# Altium schematic sheet clock-3key.SchDoc
size A3; SPICEModelCacheRLVYLVLF: <root> / <DocumentId>RLVYLVLF</DocumentId> / <CacheFrame Number="0"> / <Model Name="qnpn" Kind="MDL"> / <Text>*QNPN / *NPN Trans Pinout: C,B,E / .MODEL QNPN NPN(IS=3.2E-16 BF=141 VAF=35 ISE=2.6 NE=1.46 CJE=1E-13 / + MJE=0.333 TF=6E-11 CJC=1E-13 CJS=2.2E-13 MJS=0.5 FC=0.67 )</Text> / </Model> / <Model Name="dtunnel1" Kind="CKT"> / <Text>*Tunnel Diode Default / *MCE 600V 50A 27.2ns default parameters / *Diode Pinout: A,K / * Parameters: / * RS:  Series resistance value / * RP:  Negative resistance value in parallel with capacitance. / * CP:   Capacitance value in parallel with negative resistance. / * LS:  Series inductance value. / * / * / .SUBCKT DTUNNEL1 1 2 PARAMS: Rs=6 Rp=-75 Cp=0.6E-12 Ls=0.1nH / RS  1 3  {Rs} / RP  3 4  {Rp} / CP  3 4  {Cp} / LS  4 2  {Ls} / .ENDS DTUNNEL1</Text> / </Model> / <Model Name="pnp" Kind="MDL"> / <Text>*Default PNP BJT / *PNP Trans Pinout: C,B,E / .MODEL PNP PNP()</Text> / </Model> / </CacheFrame> / </root>
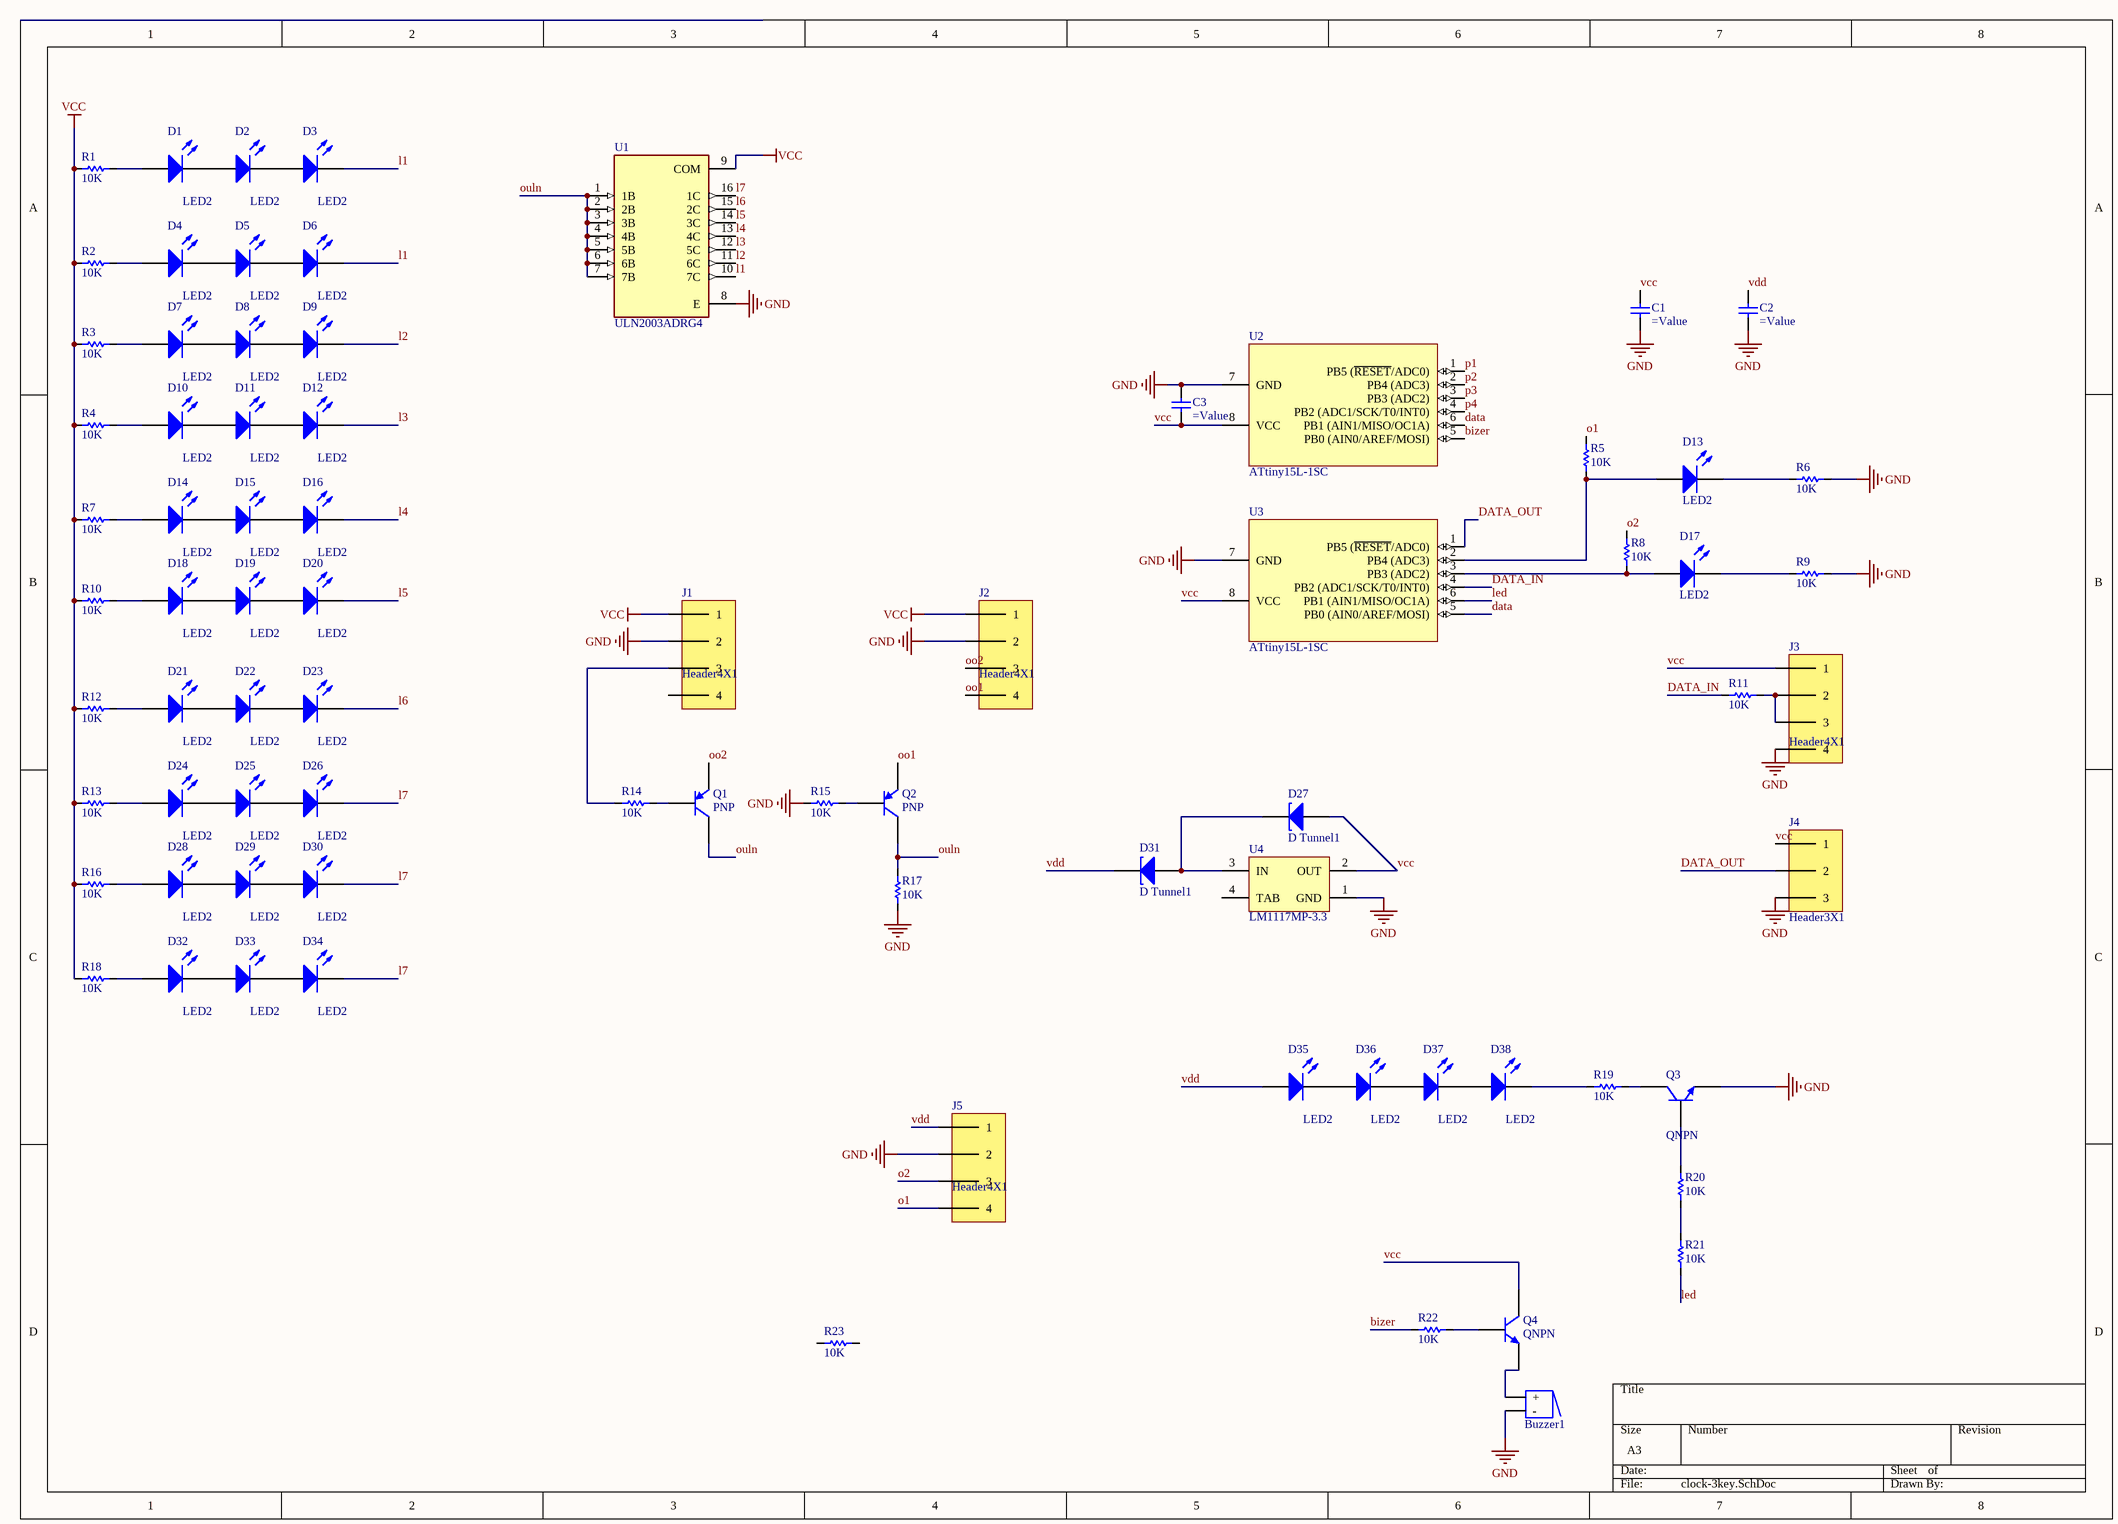
[diagram p0: clock-3key.SchDoc]

## Parts
Buzzer1  Buzzer  [BUZZER]  (value not drawn)
C1  (no value)  [CAP 1206]
C2  (no value)  [CAP 1206]
C3  (no value)  [CAP 1206]
D1  LED2  [3.2X1.6X1.1]
D2  LED2  [3.2X1.6X1.1]
D3  LED2  [3.2X1.6X1.1]
D4  LED2  [3.2X1.6X1.1]
D5  LED2  [3.2X1.6X1.1]
D6  LED2  [3.2X1.6X1.1]
D7  LED2  [3.2X1.6X1.1]
D8  LED2  [3.2X1.6X1.1]
D9  LED2  [3.2X1.6X1.1]
D10  LED2  [3.2X1.6X1.1]
D11  LED2  [3.2X1.6X1.1]
D12  LED2  [3.2X1.6X1.1]
D13  LED2  [3.2X1.6X1.1]
D14  LED2  [3.2X1.6X1.1]
D15  LED2  [3.2X1.6X1.1]
D16  LED2  [3.2X1.6X1.1]
D17  LED2  [3.2X1.6X1.1]
D18  LED2  [3.2X1.6X1.1]
D19  LED2  [3.2X1.6X1.1]
D20  LED2  [3.2X1.6X1.1]
D21  LED2  [3.2X1.6X1.1]
D22  LED2  [3.2X1.6X1.1]
D23  LED2  [3.2X1.6X1.1]
D24  LED2  [3.2X1.6X1.1]
D25  LED2  [3.2X1.6X1.1]
D26  LED2  [3.2X1.6X1.1]
D27  D Tunnel1  [3.2X1.6X1.1]
D28  LED2  [3.2X1.6X1.1]
D29  LED2  [3.2X1.6X1.1]
D30  LED2  [3.2X1.6X1.1]
D31  D Tunnel1  [3.2X1.6X1.1]
D32  LED2  [3.2X1.6X1.1]
D33  LED2  [3.2X1.6X1.1]
D34  LED2  [3.2X1.6X1.1]
D35  LED2  [3.2X1.6X1.1]
D36  LED2  [3.2X1.6X1.1]
D37  LED2  [3.2X1.6X1.1]
D38  LED2  [3.2X1.6X1.1]
J1  Header4X1  [HEADER 4X1]
J2  Header4X1  [HEADER 4X1]
J3  Header4X1  [HEADER 4X1]
J4  Header3X1  [HEADER 3X1]
J5  Header4X1  [HEADER 4X1]
Q1  PNP  [SOT-23B_N]
Q2  PNP  [SOT-23B_N]
Q3  QNPN  [SOT-23B_L]
Q4  QNPN  [SOT-23B_L]
R1  10K  [RES 1206 (3216X08L)]
R2  10K  [RES 1206 (3216X08L)]
R3  10K  [RES 1206 (3216X08L)]
R4  10K  [RES 1206 (3216X08L)]
R5  10K  [RES 1206 (3216X08L)]
R6  10K  [RES 1206 (3216X08L)]
R7  10K  [RES 1206 (3216X08L)]
R8  10K  [RES 1206 (3216X08L)]
R9  10K  [RES 1206 (3216X08L)]
R10  10K  [RES 1206 (3216X08L)]
R11  10K  [RES 1206 (3216X08L)]
R12  10K  [RES 1206 (3216X08L)]
R13  10K  [RES 1206 (3216X08L)]
R14  10K  [RES 1206 (3216X08L)]
R15  10K  [RES 1206 (3216X08L)]
R16  10K  [RES 1206 (3216X08L)]
R17  10K  [RES 1206 (3216X08L)]
R18  10K  [RES 1206 (3216X08L)]
R19  10K  [RES 1206 (3216X08L)]
R20  10K  [RES 1206 (3216X08L)]
R21  10K  [RES 1206 (3216X08L)]
R22  10K  [RES 1206 (3216X08L)]
R23  10K  [RES 1206 (3216X08L)]
U1  ULN2003ADRG4  [SOIC127P600X175-16N]
U2  ATtiny15L-1SC  [8S2_N]
U3  ATtiny15L-1SC  [8S2_N]
U4  LM1117MP-3.3  [SOT89L]

## Nets
GND: Buzzer1.2(-) C1.1(+) C2.1(+) C3.2(-) J1.2 J2.2 J3.4 J4.3 J5.2 Q3.3(E) R6.2 R9.2 R15.1 R17.1 U1.8(E) U2.7(GND) U3.7(GND) U4.1(GND)
vcc: C1.2(-) C3.1(+) D27.1(A) J1.1 J2.1 J3.1 J4.1 Q4.1(C) R1.1 R2.1 R3.1 R4.1 R7.1 R10.1 R12.1 R13.1 R16.1 R18.1 U1.9(COM) U2.8(VCC) U3.8(VCC) U4.2(OUT)
bizer: R22.1 U2.5(PB0_(AIN0/AREF/MOSI))
data: U2.6(PB1_(AIN1/MISO/OC1A)) U3.5(PB0_(AIN0/AREF/MOSI))
DATA_IN: R11.1 U3.4(PB2_(ADC1/SCK/T0/INT0))
DATA_OUT: J4.2 U3.1(PB5_(~{RESET}/ADC0))
l1: D3.2(K) D6.2(K) U1.10(7C)
l2: D9.2(K) U1.11(6C)
l3: D12.2(K) U1.12(5C)
l4: D16.2(K) U1.13(4C)
l5: D20.2(K) U1.14(3C)
l6: D23.2(K) U1.15(2C)
l7: D26.2(K) D30.2(K) D34.2(K) U1.16(1C)
led: R21.1 U3.6(PB1_(AIN1/MISO/OC1A))
o1: J5.4 R5.2
o2: J5.3 R8.2
oo1: J2.4 Q2.3(E)
oo2: J2.3 Q1.3(E)
ouln: Q1.1(C) Q2.1(C) R17.2 U1.1(1B) U1.2(2B) U1.3(3B) U1.4(4B) U1.5(5B) U1.6(6B) U1.7(7B)
p1: U2.1(PB5_(~{RESET}/ADC0))
p2: U2.2(PB4_(ADC3))
p3: U2.3(PB3_(ADC2))
p4: U2.4(PB2_(ADC1/SCK/T0/INT0))
vdd: C2.2(-) D31.2(K) D35.1(A) J5.1
NetBuzzer1_1: Buzzer1.1(+) Q4.3(E)
NetD1_1: D1.1(A) R1.2
NetD1_2: D1.2(K) D2.1(A)
NetD2_2: D2.2(K) D3.1(A)
NetD4_1: D4.1(A) R2.2
NetD4_2: D4.2(K) D5.1(A)
NetD5_2: D5.2(K) D6.1(A)
NetD7_1: D7.1(A) R3.2
NetD7_2: D7.2(K) D8.1(A)
NetD8_2: D8.2(K) D9.1(A)
NetD10_1: D10.1(A) R4.2
NetD10_2: D10.2(K) D11.1(A)
NetD11_2: D11.2(K) D12.1(A)
NetD13_1: D13.1(A) R5.1 U3.2(PB4_(ADC3))
NetD13_2: D13.2(K) R6.1
NetD14_1: D14.1(A) R7.2
NetD14_2: D14.2(K) D15.1(A)
NetD15_2: D15.2(K) D16.1(A)
NetD17_1: D17.1(A) R8.1 U3.3(PB3_(ADC2))
NetD17_2: D17.2(K) R9.1
NetD18_1: D18.1(A) R10.2
NetD18_2: D18.2(K) D19.1(A)
NetD19_2: D19.2(K) D20.1(A)
NetD21_1: D21.1(A) R12.2
NetD21_2: D21.2(K) D22.1(A)
NetD22_2: D22.2(K) D23.1(A)
NetD24_1: D24.1(A) R13.2
NetD24_2: D24.2(K) D25.1(A)
NetD25_2: D25.2(K) D26.1(A)
NetD27_2: D27.2(K) D31.1(A) U4.3(IN)
NetD28_1: D28.1(A) R16.2
NetD28_2: D28.2(K) D29.1(A)
NetD29_2: D29.2(K) D30.1(A)
NetD32_1: D32.1(A) R18.2
NetD32_2: D32.2(K) D33.1(A)
NetD33_2: D33.2(K) D34.1(A)
NetD35_2: D35.2(K) D36.1(A)
NetD36_2: D36.2(K) D37.1(A)
NetD37_2: D37.2(K) D38.1(A)
NetD38_2: D38.2(K) R19.1
NetJ1_3: J1.3 R14.1
NetJ3_2: J3.2 J3.3 R11.2
NetQ1_2: Q1.2(B) R14.2
NetQ2_2: Q2.2(B) R15.2
NetQ3_1: Q3.1(C) R19.2
NetQ3_2: Q3.2(B) R20.2
NetQ4_2: Q4.2(B) R22.2
NetR20_1: R20.1 R21.2

Not connected (* = marked no-connect by the designer): J1 4; R23 1 2; U4 4(TAB)

## Library data of the parts
Buzzer1 = Buzzer: Designer: Seyed Mohsen Ghasemain; ComponentLinkURL: www.picpars.com
C1-C3 = Capacitor
D1-D26 D28-D30 D32-D38 = LED2: Typical RED, GREEN, YELLOW, AMBER GaAs LED; Published: 8-Jun-2000; LatestRevisionDate: 17-Jul-2002; LatestRevisionNote: Re-released for DXP Platform.; PackageVersion: Feb-2002; PackageReference: 3.2X1.6X1.1; Publisher: Altium Limited; PackageDescription: SM LED; 2 Flat Leads
D27 D31 = D Tunnel1: Tunnel Diode - RLC Model; Published: 8-Jun-2000; LatestRevisionDate: 17-Jul-2002; LatestRevisionNote: Re-released for DXP Platform.; PackageVersion: Feb-2002; PackageReference: 3.2X1.6X1.1; Publisher: Altium Limited; PackageDescription: SM LED; 2 Flat Leads
Q1 Q2 = PNP: PNP Bipolar Transistor; pin to pad: 1>3 2>1 3>2; Published: 8-Jun-2000; LatestRevisionDate: 29-May-2009; LatestRevisionNote: IPC-7351 Footprint Added.; PackageVersion: Aug-1999; PackageReference: SOT-23B; Publisher: Altium Limited; PackageDescription: 3-Pin SOT-23 Package 0.95 mm Pitch, 2.4 mm Lead Span
Q3 Q4 = QNPN: NPN Bipolar Transistor; pin to pad: 1>3 2>1 3>2; Published: 8-Jun-2000; LatestRevisionDate: 29-May-2009; LatestRevisionNote: IPC-7351 Footprint Added.; PackageVersion: Aug-1999; PackageReference: SOT-23B; Publisher: Altium Limited; PackageDescription: 3-Pin SOT-23 Package 0.95 mm Pitch, 2.4 mm Lead Span
R1-R23 = Resistor: Tolerance: 5%; Power: 1/4 W; Value: 10K
U1 = ULN2003ADRG4: 50-V, 7-ch darlington transistor array, -20C to 70C 16-SOIC -40 to 70; Price: None; MP: ULN2003ADRG4; Availability: Unavailable; Package: None; Value: *
U2 = ATtiny15L-1SC: 8-Bit AVR Microcontroller with 1K Byte of Flash Memory; Published: 17-Sep-2003; LatestRevisionDate: 16-Oct-2006; LatestRevisionNote: IPC-7351 Footprint Added.; DatasheetVersion: 1187E-AVR-06/02; PackageVersion: revF, Apr-2008; PackageReference: 8S2; Publisher: Altium Limited; PackageDescription: 8-Lead, 0.208" Body, Plastic Small Outline Package (EIAJ); Supplier 1: Digi-Key; Supplier Part Number 1: ATTINY15L-1SC-ND; Supplier 2: Mouser; Supplier Part Number 2: 556-ATTINY15L1SC; ComponentLink1Description: Datasheet; ComponentLink1URL: http://www.atmel.com/dyn/resources/prod_documents/doc1187.pdf; ComponentLink2Description: Atmel.com Home; ComponentLink2URL: http://www.atmel.com
U3 = ATtiny15L-1SC: 8-Bit AVR Microcontroller with 1K Byte of Flash Memory; pin to pad: 1>7 7>8 8>1; Published: 17-Sep-2003; LatestRevisionDate: 16-Oct-2006; LatestRevisionNote: IPC-7351 Footprint Added.; DatasheetVersion: 1187E-AVR-06/02; PackageVersion: revF, Apr-2008; PackageReference: 8S2; Publisher: Altium Limited; PackageDescription: 8-Lead, 0.208" Body, Plastic Small Outline Package (EIAJ); Supplier 1: Digi-Key; Supplier Part Number 1: ATTINY15L-1SC-ND; Supplier 2: Mouser; Supplier Part Number 2: 556-ATTINY15L1SC; ComponentLink1Description: Datasheet; ComponentLink1URL: http://www.atmel.com/dyn/resources/prod_documents/doc1187.pdf; ComponentLink2Description: Atmel.com Home; ComponentLink2URL: http://www.atmel.com
U4 = LM1117MP-3.3: 800mA Low-Dropout Linear Regulator; pin to pad: 1>2 2>1; Manufacturer: National Semiconductor; CompType: LDO IC; PackageTopMarking: XYTT*N05A; PowerWise: N; Published: 4-Dec-2008; DatasheetVersion: Apr-2006; PackageVersion: revB, Apr-2003; PackageReference: MP04A; Publisher: Altium Limited; PackageDescription: Molded SOT-223, 6.50 x 3.56 x 1.6mm Body, 4 Lead, 2.3mm Pitch; PartNumber: LM1117MP-3.3; RoHS: O; PinCount: 4; DigiKeyPartNumber: LM1117MP-3.3CT-ND; Code_JEDEC: TO-261-AA; Code_IPC: SOT223-4; ComponentLink1Description: LM1117 Datasheet; ComponentLink1URL: http://www.national.com/ds/LM/LM1117.pdf; ComponentLink2Description: LM1117 Web Page; ComponentLink2URL: http://www.national.com/pf/LM/LM1117.html; ComponentLink3Description: MP04A Package Page; ComponentLink3URL: http://www.national.com/packaging/folders/mp04a.html